# EAGLE design dropper_torpedo (EAGLE 7.6.0)
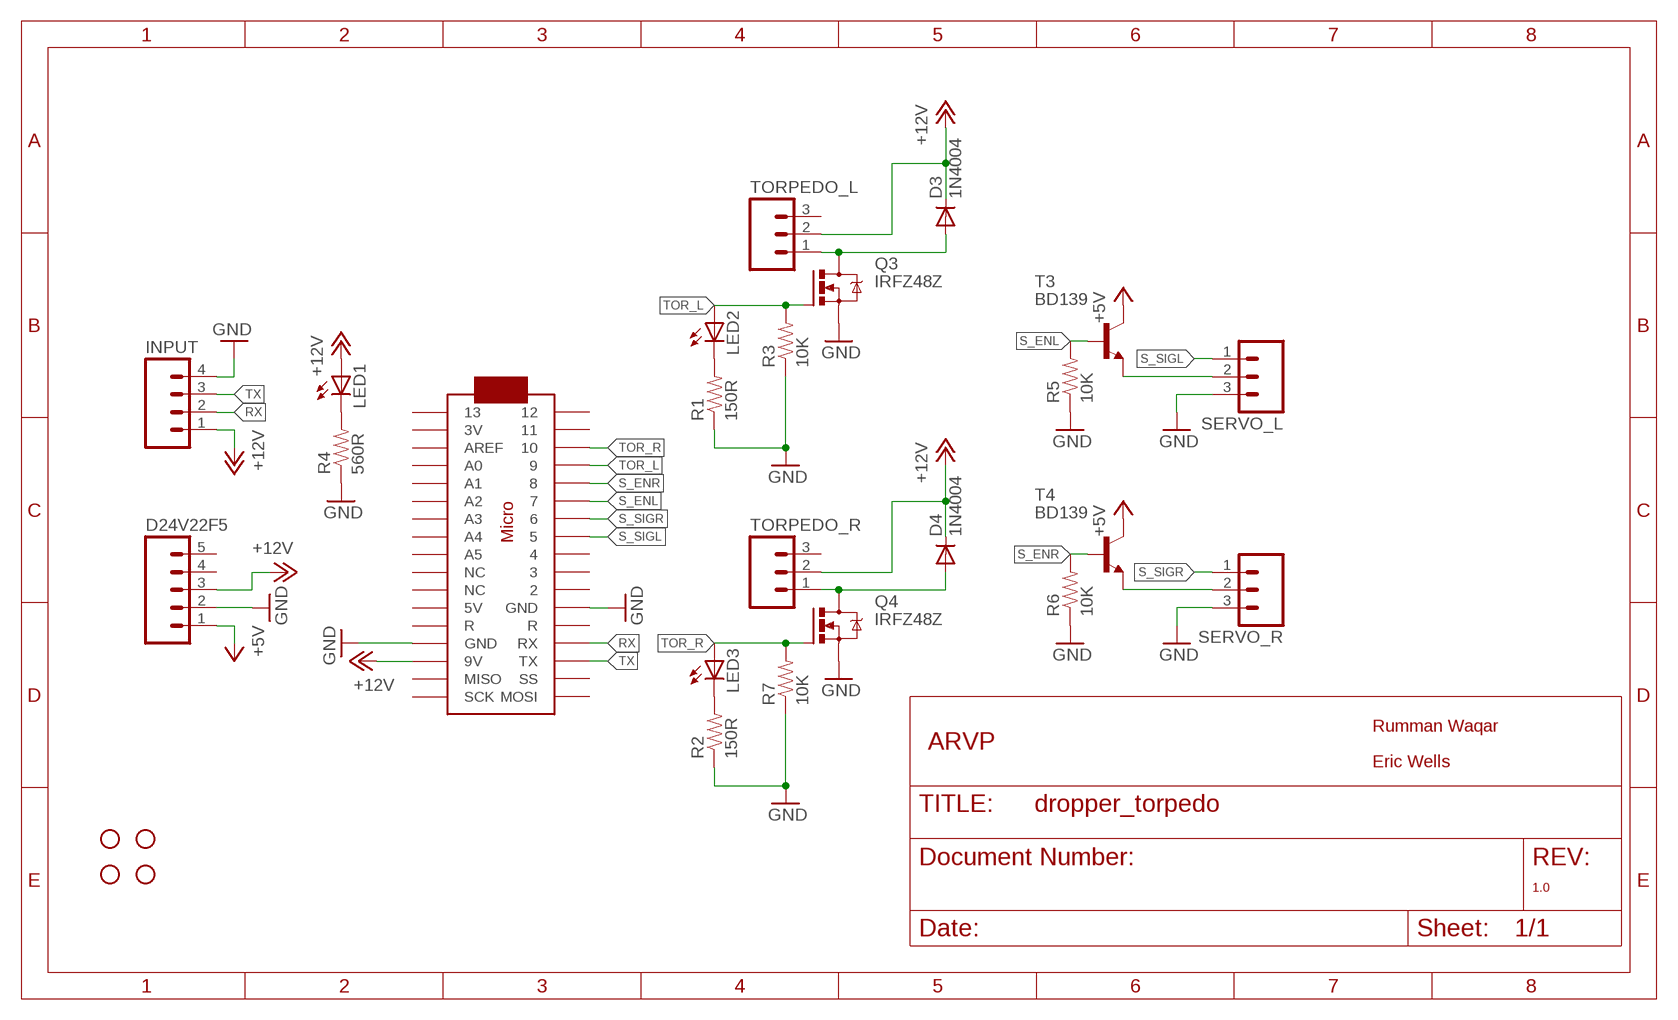
[diagram p0: schematic, sheet 1]

## Parts
D3  1N4004  [DO41-10]
D4  1N4004  [DO41-10]
D24V22F5  M05PTH  [1X05]
INPUT  M04POLAR  [MOLEX-1X4]
JP1  STAND-OFF  [STAND-OFF]
JP2  STAND-OFF  [STAND-OFF]
JP3  STAND-OFF  [STAND-OFF]
JP4  STAND-OFF  [STAND-OFF]
LED1  LED0603  [LED-0603]
LED2  LED0603  [LED-0603]
LED3  LED0603  [LED-0603]
Q3  IRFZ48Z  [TO220BH]
Q4  IRFZ48Z  [TO220BH]
R1  150R  RESISTOR0805-RES  [0805]
R2  150R  RESISTOR0805-RES  [0805]
R3  10K  RESISTOR0805-RES  [0805]
R4  560R  RESISTOR0805-RES  [0805]
R5  10K  RESISTOR0805-RES  [0805]
R6  10K  RESISTOR0805-RES  [0805]
R7  10K  RESISTOR0805-RES  [0805]
SERVO_L  M03POLAR  [MOLEX-1X3]
SERVO_R  M03POLAR  [MOLEX-1X3]
T3  BD139  [TO126]
T4  BD139  [TO126]
TORPEDO_L  M03POLAR  [MOLEX-1X3]
TORPEDO_R  M03POLAR  [MOLEX-1X3]
U$1  ARVP_LOGO  [ARVP]
U$2  ARDUINOMICRO  [ARDUINOMICRO]

## Nets
+5V: D24V22F5.1 T3.2(C) T4.2(C)
+12V: D3.C D4.C D24V22F5.3 INPUT.1 LED1.A TORPEDO_L.2 TORPEDO_R.2 U$2.P$20(9V)
GND: D24V22F5.2 INPUT.4 Q3.S Q4.S R1.1 R2.1 R3.1 R4.1 R5.1 R6.1 R7.1 SERVO_L.3 SERVO_R.3 U$2.P$12(GND) U$2.P$21(GND)
N$1: D3.A Q3.D TORPEDO_L.1
N$3: LED2.C R1.2
N$4: D4.A Q4.D TORPEDO_R.1
N$5: LED3.C R2.2
N$10: LED1.C R4.2
N$13: SERVO_L.2 T3.1(E)
N$14: SERVO_R.2 T4.1(E)
RX: INPUT.2 U$2.P$14(RX)
S_ENL: R5.2 T3.3(B) U$2.P$6
S_ENR: R6.2 T4.3(B) U$2.P$5
S_SIGL: SERVO_L.1 U$2.P$8
S_SIGR: SERVO_R.1 U$2.P$7
TOR_L: LED2.A Q3.G R3.2 U$2.P$4
TOR_R: LED3.A Q4.G R7.2 U$2.P$3
TX: INPUT.3 U$2.P$15(TX)
Unconnected: D24V22F5.4 D24V22F5.5 TORPEDO_L.3 TORPEDO_R.3 U$2.P$1 U$2.P$2 U$2.P$9 U$2.P$10 U$2.P$11 U$2.P$13(R) U$2.P$16(SS) U$2.P$17(MOSI) U$2.P$18(SCK) U$2.P$19(MISO) U$2.P$22(R) U$2.P$23(5V) U$2.P$24(NC) U$2.P$25(NC) U$2.P$26(A5) U$2.P$27(A4) U$2.P$28(A3) U$2.P$29(A2) U$2.P$30(A1) U$2.P$31(A0) U$2.P$32(AREF) U$2.P$33(3V) U$2.P$34

## Notes on the sheet
- Rumman Waqar
- Eric Wells
- 1.0

## Library data of the parts
D3 D4 = diode:1N4004: DIODE general purpose rectifier, 1 A
D24V22F5 = SparkFun:M05: Header 5 Standard 5-pin 0.1" header. Use with straight break away headers (SKU : PRT-00116), right angle break away headers (PRT-00553), swiss pins (PRT-00743), machine pins (PRT-00117), and female headers (PRT-00115). Molex polarized connector foot print use with SKU : PRT-08230 with associated crimp pins and housings.
INPUT = SparkFun:M04: Header 4 Standard 4-pin 0.1" header. Use with straight break away headers (SKU : PRT-00116), right angle break away headers (PRT-00553), swiss pins (PRT-00743), machine pins (PRT-00117), and female headers (PRT-00115). Molex polarized connector foot print use with SKU : PRT-08231 with associated crimp pins and housings. 1MM SMD Version SKU: PRT-10208
JP1-JP4 = SparkFun:STAND-OFF: Stand Off This is the mechanical footprint for a #4 phillips button head screw. Use the keepout ring to avoid running the screw head into surrounding components. SKU : PRT-00447
LED1-LED3 = SparkFun:LED: LEDs Standard schematic elements and footprints for 5mm, 3mm, 1206, and 0603 sized LEDs. 5mm - Spark Fun Electronics SKU : COM-00529 (and others)
Q3 Q4 = transistor-power:IRFZ48: N Channel HEXFET® Power MOSFET Logic Level Source: http://www.irf.com/product-info/datasheets/data/irfz48z.pdf
R1-R7 = SparkFun:RESISTOR: Resistor Basic schematic elements and footprints for 0603, 1206, and PTH resistors.
SERVO_L SERVO_R TORPEDO_L TORPEDO_R = SparkFun:M03: Header 3 Standard 3-pin 0.1" header. Use with straight break away headers (SKU : PRT-00116), right angle break away headers (PRT-00553), swiss pins (PRT-00743), machine pins (PRT-00117), and female headers (PRT-00115). Molex polarized connector foot print use with SKU : PRT-08232 with associated crimp pins and housings.
T3 T4 = transistor:BD139: NPN TRANSISTOR
U$1 = ARVP:ARVP_LOGO
U$2 = adafruit:ARDUINOMICRO

## Board
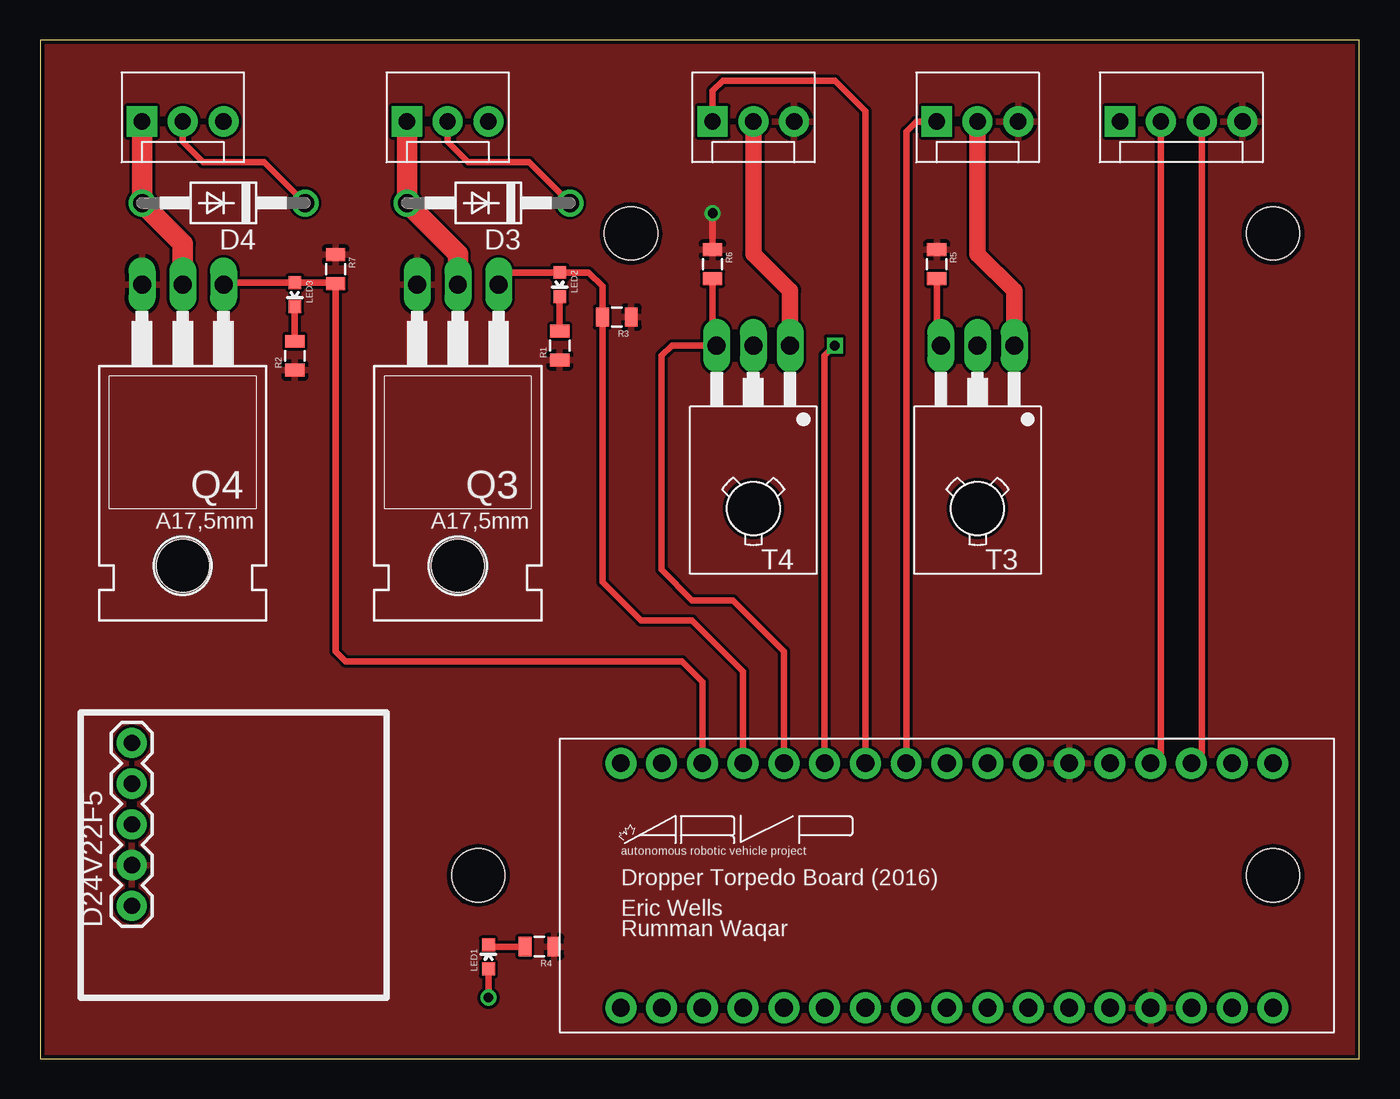
[diagram p1: board, top side]
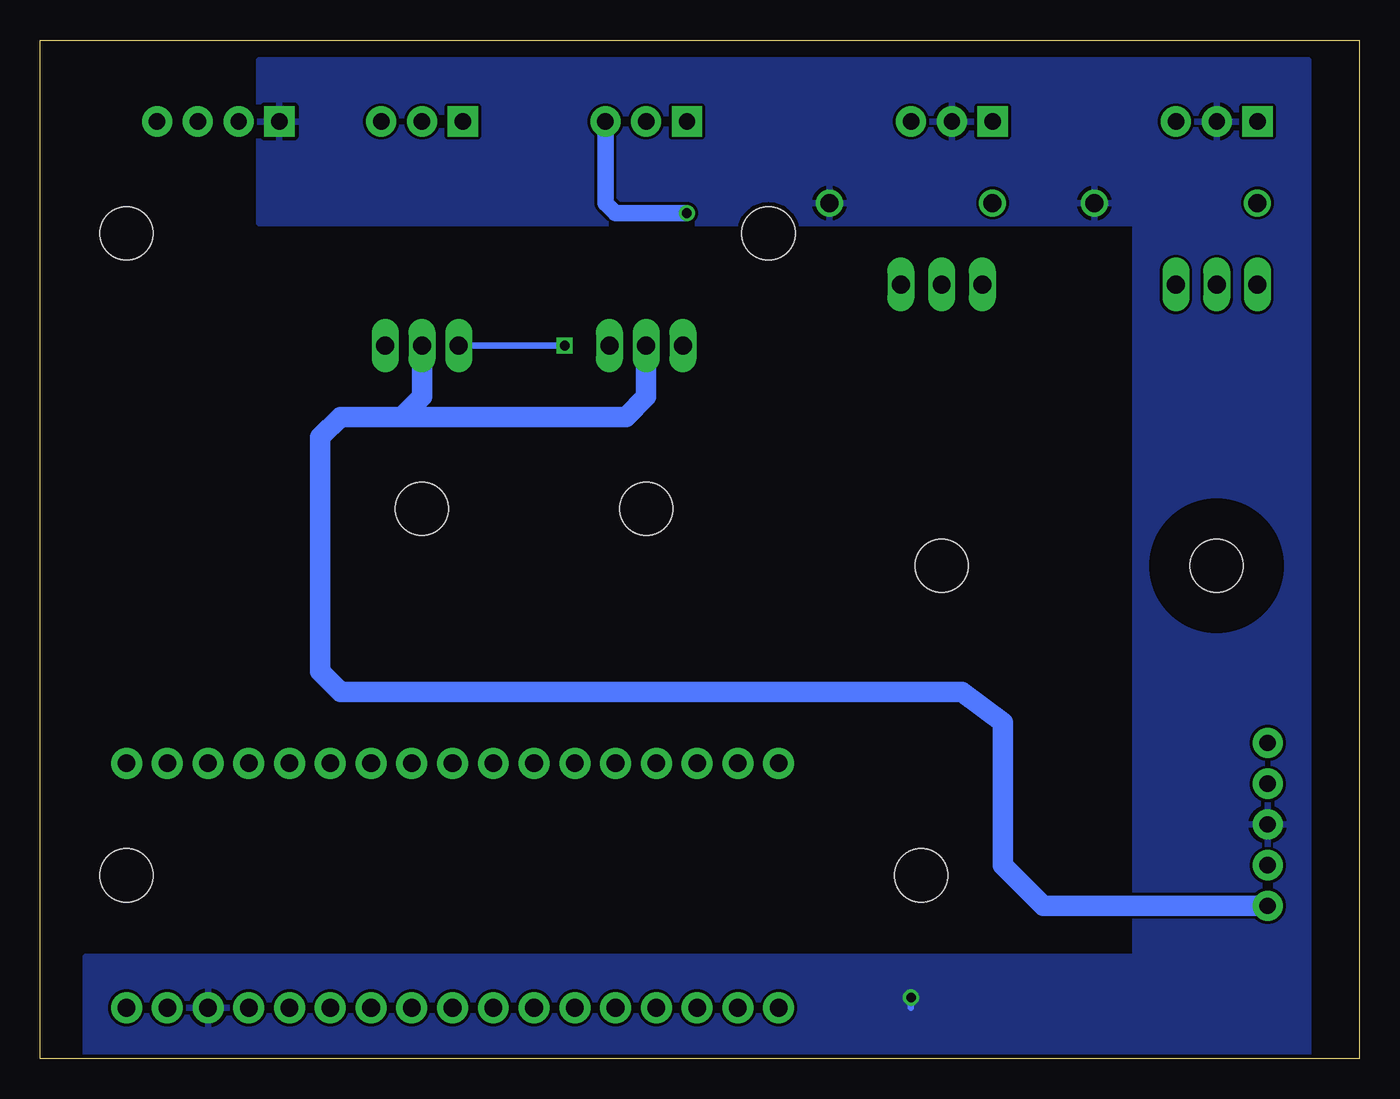
[diagram p2: board, bottom side, seen from below]

Size 82.22 x 63.49 mm. Coordinates in mm from the lower left corner, seen from the top.
Outline: 82.22,0 82.22,63.49 0,63.49 0,0 82.22,0
Copper layers (1*16): Top 0.035mm / dielectric 1.5mm / Bottom 0.035mm
Design rules "apcircuits": minimum track width 0.18mm, minimum drill 20mil, track to track 0.18mm, track to pad 0.18mm, pad to pad 0.18mm, via to via 0.18mm, smd to smd 0.18mm, copper to edge 0.25mm, drill to drill 0.25mm, minimum pad ring 10mil, minimum via ring 8mil, stop-mask expansion 4mil, vias tented up to drill 0mil, thermal gap 10mil

### Footprints (pad centres in the part's own frame; a part is rotated, then mirrored left to right if it is on the bottom)
DO41-10 = drill 1.118: A 5.08,0; C -5.08,0
1X05 = drill 1.016 pad 1.88: 1 0,0; 2 2.54,0; 3 5.08,0; 4 7.62,0; 5 10.16,0
MOLEX-1X4 = drill 1.016 pad 1.88 square: 1 0,0 | drill 1.016 pad 1.88: 2 2.54,0; 3 5.08,0; 4 7.62,0
STAND-OFF = hole 3.302: 0,0
LED-0603 = smd 0.8 x 0.8: A 0,-0.75; C 0,0.75
TO220BH = drill 1.118 long: D 0,-6.35; G -2.54,-6.35; S 2.54,-6.35 | hole 3.302: 0,11.176
0805 = smd 0.8 x 1.2: 1 -0.9,0; 2 0.9,0
MOLEX-1X3 = drill 1.016 pad 1.88 square: 1 0,0 | drill 1.016 pad 1.88: 2 2.54,0; 3 5.08,0
TO126 = drill 1.118 long: 1 -2.286,-5.08; 2 0,-5.08; 3 2.286,-5.08 | hole 3.302: 0,5.08
ARDUINOMICRO = drill 1.1 pad 1.93: P$1 -20.32,7.62; P$2 -17.78,7.62; P$3 -15.24,7.62; P$4 -12.7,7.62; P$5 -10.16,7.62; P$6 -7.62,7.62; P$7 -5.08,7.62; P$8 -2.54,7.62; P$9 0,7.62; P$10 2.54,7.62; P$11 5.08,7.62; P$12 12.7,-7.62; P$13 10.16,-7.62; P$14 12.7,7.62; P$15 15.24,7.62; P$16 17.78,7.62; P$17 20.32,7.62; P$18 20.32,-7.62; P$19 17.78,-7.62; P$20 15.24,-7.62; P$21 7.62,7.62; P$22 10.16,7.62; P$23 7.62,-7.62; P$24 5.08,-7.62; P$25 2.54,-7.62; P$26 0,-7.62; P$27 -2.54,-7.62; P$28 -5.08,-7.62; P$29 -7.62,-7.62; P$30 -10.16,-7.62; P$31 -12.7,-7.62; P$32 -15.24,-7.62; P$33 -17.78,-7.62; P$34 -20.32,-7.62

### Placement (x,y rotation side)
D3  27.94,53.34 180 top
D4  11.43,53.34 180 top
D24V22F5  5.71,9.52 90 top
INPUT  67.31,58.42 0 top
JP1  76.83,51.43 0 top
JP2  36.83,51.43 0 top
JP3  27.3,11.43 0 top
JP4  76.83,11.43 0 top
LED1  27.94,6.35 0 top
LED2  32.38,48.26 180 top
LED3  15.88,47.62 180 top
Q3  26.04,41.91 180 top
Q4  8.89,41.91 180 top
R1  32.38,44.45 90 top
R2  15.88,43.81 90 top
R3  35.94,46.23 180 top
R4  31.11,6.98 180 top
R5  55.88,49.53 270 top
R6  41.91,49.53 270 top
R7  18.41,49.21 270 top
SERVO_L  55.88,58.42 0 top
SERVO_R  41.91,58.42 0 top
T3  58.42,39.37 180 top
T4  44.45,39.37 180 top
TORPEDO_L  22.86,58.42 0 top
TORPEDO_R  6.35,58.42 0 top
U$1  36.2,12.7 0 top
U$2  56.52,10.79 0 top

### Tracks (layer width: path | path; a pad name or v marks a point on that pad's centre or on a via)
+5V
  Bottom 1.27: D24V22F5.1 19.68,9.52 22.23,12.06 22.23,20.96 24.77,22.86 63.5,22.86 64.77,24.13 64.77,38.73 63.5,40 59.69,40 | 59.69,40 58.42,41.27 T3.2 | T4.2 44.45,41.27 45.72,40 59.69,40
+12V  (via drill 0.6)
  Top 0.406: TORPEDO_L.2 25.4,57.15 26.67,55.88 30.48,55.88 D3.C | TORPEDO_R.2 8.89,57.15 10.16,55.88 13.97,55.88 D4.C | LED1.A v27.94,3.81
  Bottom 0.406: v27.94,3.81 27.94,3.17
  pour Bottom: 79.38,6.35 79.38,0 3.17,0 3.17,62.23 68.58,62.23 68.58,52.07 13.97,52.07 13.97,6.35
GND  (via drill 0.6)
  Top 0.406: R6.1 v41.91,52.7
  Bottom 1.016: v41.91,52.7 46.35,52.7 46.99,53.34 SERVO_R.3
  pour Top: -2.54,64.77 85.72,64.77 85.72,-3.81 -2.54,-3.81
N$1
  Top 1.27: TORPEDO_L.1 D3.A 26.04,50.16 Q3.D
N$3
  Top 0.406: R1.2 LED2.C
N$4
  Top 1.27: TORPEDO_R.1 D4.A 8.89,50.8 Q4.D
N$5
  Top 0.406: LED3.C R2.2
N$10
  Top 0.406: R4.2 28.05,6.98 LED1.C
N$13
  Top 1.016: SERVO_L.2 58.42,50.16 60.71,47.88 T3.1
N$14
  Top 1.016: SERVO_R.2 44.45,50.16 46.74,47.88 T4.1
RX
  Top 0.406: INPUT.2 69.85,19.05 U$2.P$14
S_ENL  (via drill 0.6)
  Top 0.406: R5.2 55.88,44.7 T3.3 | U$2.P$6 48.9,43.81 v49.53,44.45
  Bottom 0.406: v49.53,44.45 T3.3
S_ENR
  Top 0.406: R6.2 41.91,44.7 T4.3 39.37,44.45 38.73,43.81 38.73,30.48 40.64,28.57 43.18,28.57 46.35,25.4 U$2.P$5
S_SIGL
  Top 0.406: U$2.P$8 53.98,57.78 54.61,58.42 SERVO_L.1
S_SIGR
  Top 0.406: U$2.P$7 51.44,59.05 49.53,60.96 42.55,60.96 41.91,60.32 SERVO_R.1
TOR_L
  Top 0.406: Q3.G 29.32,49.01 LED2.A 34.17,49.01 35.04,48.14 R3.2 35.05,29.72 37.47,27.3 40.64,27.3 43.81,24.13 U$2.P$4
TOR_R
  Top 0.406: Q4.G 11.54,48.38 LED3.A 18.35,48.38 R7.2 18.41,25.4 19.05,24.76 40.01,24.76 41.27,23.5 U$2.P$3
TX
  Top 0.406: INPUT.3 72.39,19.05 U$2.P$15

### Text on the board
tPlace: Dropper Torpedo Board (2016) | Eric Wells | Rumman Waqar